# Altium project PIC12F675_prt_V3.PrjPcb
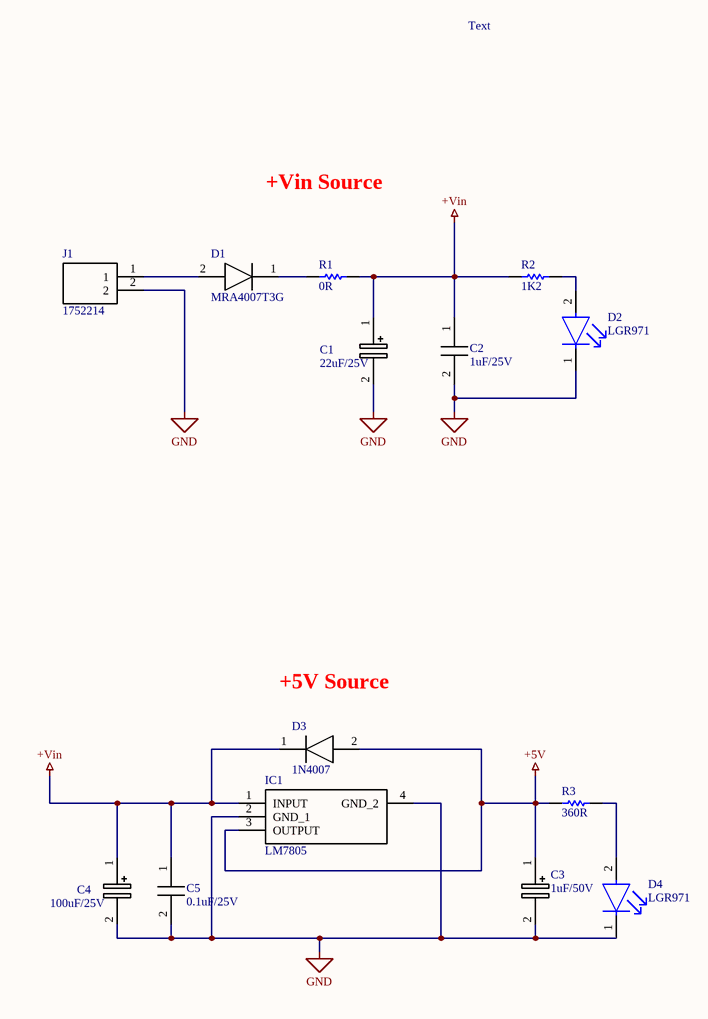
[diagram p0: power.SchDoc]
3 sheets, 82 parts. Net scope: global (net labels, ports and power ports of the same name join across sheets).
Board files: Emulator.PcbDoc, Filter.PcbDoc
Sheets:
  power.SchDoc
  uCCtrl.SchDoc
  Filter.SchDoc

## Sheet power.SchDoc
size B

### Parts
C1  22uF/25V  [CAPAE530X610N]
C2  1uF/25V  [CAPC2012X70N]
C3  1uF/50V  [CAPAE430X550N]
C4  100uF/25V  [CAPAE660X770N]
C5  0.1uF/25V  [CAPC2012X70N]
D1  MRA4007T3G  [DIOM5226X220N]
D2  LGR971  [FP-LG_R971-MFG]
D3  1N4007  [DIOM5027X244N]
D4  LGR971  [FP-LG_R971-MFG]
IC1  LM7805  [SOT230P700X180-4N]
J1  1752214  [1752214]
R1  0R  [RESC2013X55X40NL15T20]
R2  1K2  [RESC2013X55X40NL15T20]
R3  360R  [RESC2013X55X40NL15T20]

### Nets
+5V: C3.1(+) D3.2(A) IC1.3(OUTPUT) R3.2
+Vin: C1.1(+) C2.1 C4.1(+) C5.1 D3.1(K) IC1.1(INPUT) R1.2 R2.2
GND: C1.2(-) C2.2 C3.2(-) C4.2(-) C5.2 D2.1(C) D4.1(C) IC1.2(GND_1) IC1.4(GND_2) J1.2
NetD1_1: D1.1(K) R1.1
NetD1_2: D1.2(A) J1.1
NetD2_2: D2.2(A) R2.1
NetD4_2: D4.2(A) R3.1

### Notes on the sheet
- Text
- +Vin Source
- +5V Source

### Library data of the parts
C1 = APXG250ARA220ME61G: Capacitor Polarised; Manufacturer_Name: Chemi-Con; Datasheet Link: https://datasheet.datasheetarchive.com/originals/distributors/Datasheets_SAMA/b8919aa5cd8c8f60981088f28d7e01af.pdf; Height: 6.1mm; Manufacturer_Part_Number: APXG250ARA220ME61G; Mouser Part Number: 661-APXG250A220ME61G; Mouser Price/Stock: https://www.mouser.co.uk/ProductDetail/Chemi-Con/APXG250ARA220ME61G?qs=FBI%252BX3tnPf3pLyDPuxZA9A%3D%3D; Arrow Part Number: APXG250ARA220ME61G; Arrow Price/Stock: https://www.arrow.com/en/products/apxg250ara220me61g/united-chemi-con?region=nac
C2 C5 = GRM216F51E104ZA01D: Capacitor; Manufacturer_Name: Murata Electronics; Datasheet Link: http://www.murata.com/~/media/webrenewal/support/library/catalog/products/capacitor/mlcc/c02e.pdf; Height: 0.7mm; Manufacturer_Part_Number: GRM216F51E104ZA01D; Mouser Part Number: 81-GRM40Y104Z25D; Mouser Price/Stock: https://www.mouser.co.uk/ProductDetail/Murata-Electronics/GRM216F51E104ZA01D?qs=duOfYTBEatk23Zc3Fu%2FfWg%3D%3D
C3 = 865060640001: Capacitor Polarised; Manufacturer_Name: Wurth Elektronik; Datasheet Link: http://katalog.we-online.de/pbs/datasheet/865060640001.pdf; Height: 5.5mm; Manufacturer_Part_Number: 865060640001; Mouser Part Number: 710-865060640001; Mouser Price/Stock: https://www.mouser.co.uk/ProductDetail/Wurth-Elektronik/865060640001?qs=0KOYDY2FL29jNN4jHhp9bQ%3D%3D
C4 = 865090445008: Capacitor Polarised; Manufacturer_Name: Wurth Elektronik; Datasheet Link: https://componentsearchengine.com/Datasheets/1/865090445008.pdf; Height: 7.7mm; Manufacturer_Part_Number: 865090445008; Mouser Part Number: 710-865090445008; Mouser Price/Stock: https://www.mouser.co.uk/ProductDetail/Wurth-Elektronik/865090445008?qs=0KOYDY2FL2%252B%2F1BMZ3gQUdQ%3D%3D
D1 = MRA4007T3G: Diode; Manufacturer_Name: onsemi; Datasheet Link: https://www.onsemi.com/pub/Collateral/MRA4003T3-D.PDF; Height: 2.2mm; Manufacturer_Part_Number: MRA4007T3G; Mouser Part Number: 863-MRA4007T3G; Mouser Price/Stock: https://www.mouser.co.uk/ProductDetail/onsemi/MRA4007T3G?qs=ZpPixqFcBtze9zNLkB8kog%3D%3D; Arrow Part Number: MRA4007T3G; Arrow Price/Stock: https://www.arrow.com/en/products/mra4007t3g/on-semiconductor?region=nac
D2 D4 = CMP-62016-000039-1: LED GREEN DIFFUSED 0805 SMD; Test Current: 20mA; Power Dissipation: 65mW; Number of LEDs: 1; Viewing Angle: 160°; Lens Color: White; Lens Size: 1.25mm; Forward Voltage: 2.2V; Reverse Voltage: 12V; Forward Current: 25mA; Luminous Intensity: 45mcd; Luminous Flux: 0.1lm; Dominant Wavelength: 570nm; Min Operating Temperature: -30°C; Packaging: Tape and Reel; Radiation Hardening: No; Number of Pins: 2; Case Code (Imperial): 0805; Lens Style: Diffused; Mount: Surface Mount; Package Quantity: 1; Case Code (Metric): 2012; Color: Green; Case/Package: 0805; Width: 1.25mm; Illumination Color: Green; Lens Transparency: Diffused; Max Operating Temperature: 85°C; Number of Elements: 1; Depth: 1.35mm; Height: 0.9mm; Length: 2.1mm
D3 = 1n4007-SMD: Diode; Manufacturer_Name: SYC; Datasheet Link: http://www.sycelectronica.com.ar/semiconductores/1N4007-SMD.pdf; Height: 2.438mm; Manufacturer_Part_Number: 1n4007-SMD
IC1 = LM7805MPX_NOPB: Integrated Circuit; Manufacturer_Name: Texas Instruments; Manufacturer_Part_Number: LM7805MPX/NOPB; Datasheet Link: https://www.arrow.com/en/products/lm7805mpxnopb/texas-instruments; Height: 1.8mm; Mouser Part Number: 595-LM7805MPX/NOPB; Mouser Price/Stock: https://www.mouser.co.uk/ProductDetail/Texas-Instruments/LM7805MPX-NOPB?qs=gO6GG99qvRCSwIVAoVKHPw%3D%3D; Arrow Part Number: LM7805MPX/NOPB; Arrow Price/Stock: https://www.arrow.com/en/products/lm7805mpxnopb/texas-instruments?region=nac
J1 = 1752214: Connector; Manufacturer_Name: Phoenix Contact; Datasheet Link: https://datasheet.datasheetarchive.com/originals/distributors/Datasheets_SAMA/4c4c9ca6f67cab8b5ed03ba5edf5cd72.pdf; Height: 12.65mm; Manufacturer_Part_Number: 1752214; Mouser Part Number: 651-1752214; Mouser Price/Stock: https://www.mouser.co.uk/ProductDetail/Phoenix-Contact/1752214?qs=Fz3yxlUjJZFFayST2%2F%2Ff6A%3D%3D; Arrow Part Number: 1752214; Arrow Price/Stock: https://www.arrow.com/en/products/1752214/phoenix-contact?region=nac
R1-R3 = CMP-2001-04755-1: Manufacturer: Vishay Dale; Part Number: TNPW08052K00BEEN

## Sheet uCCtrl.SchDoc
size B
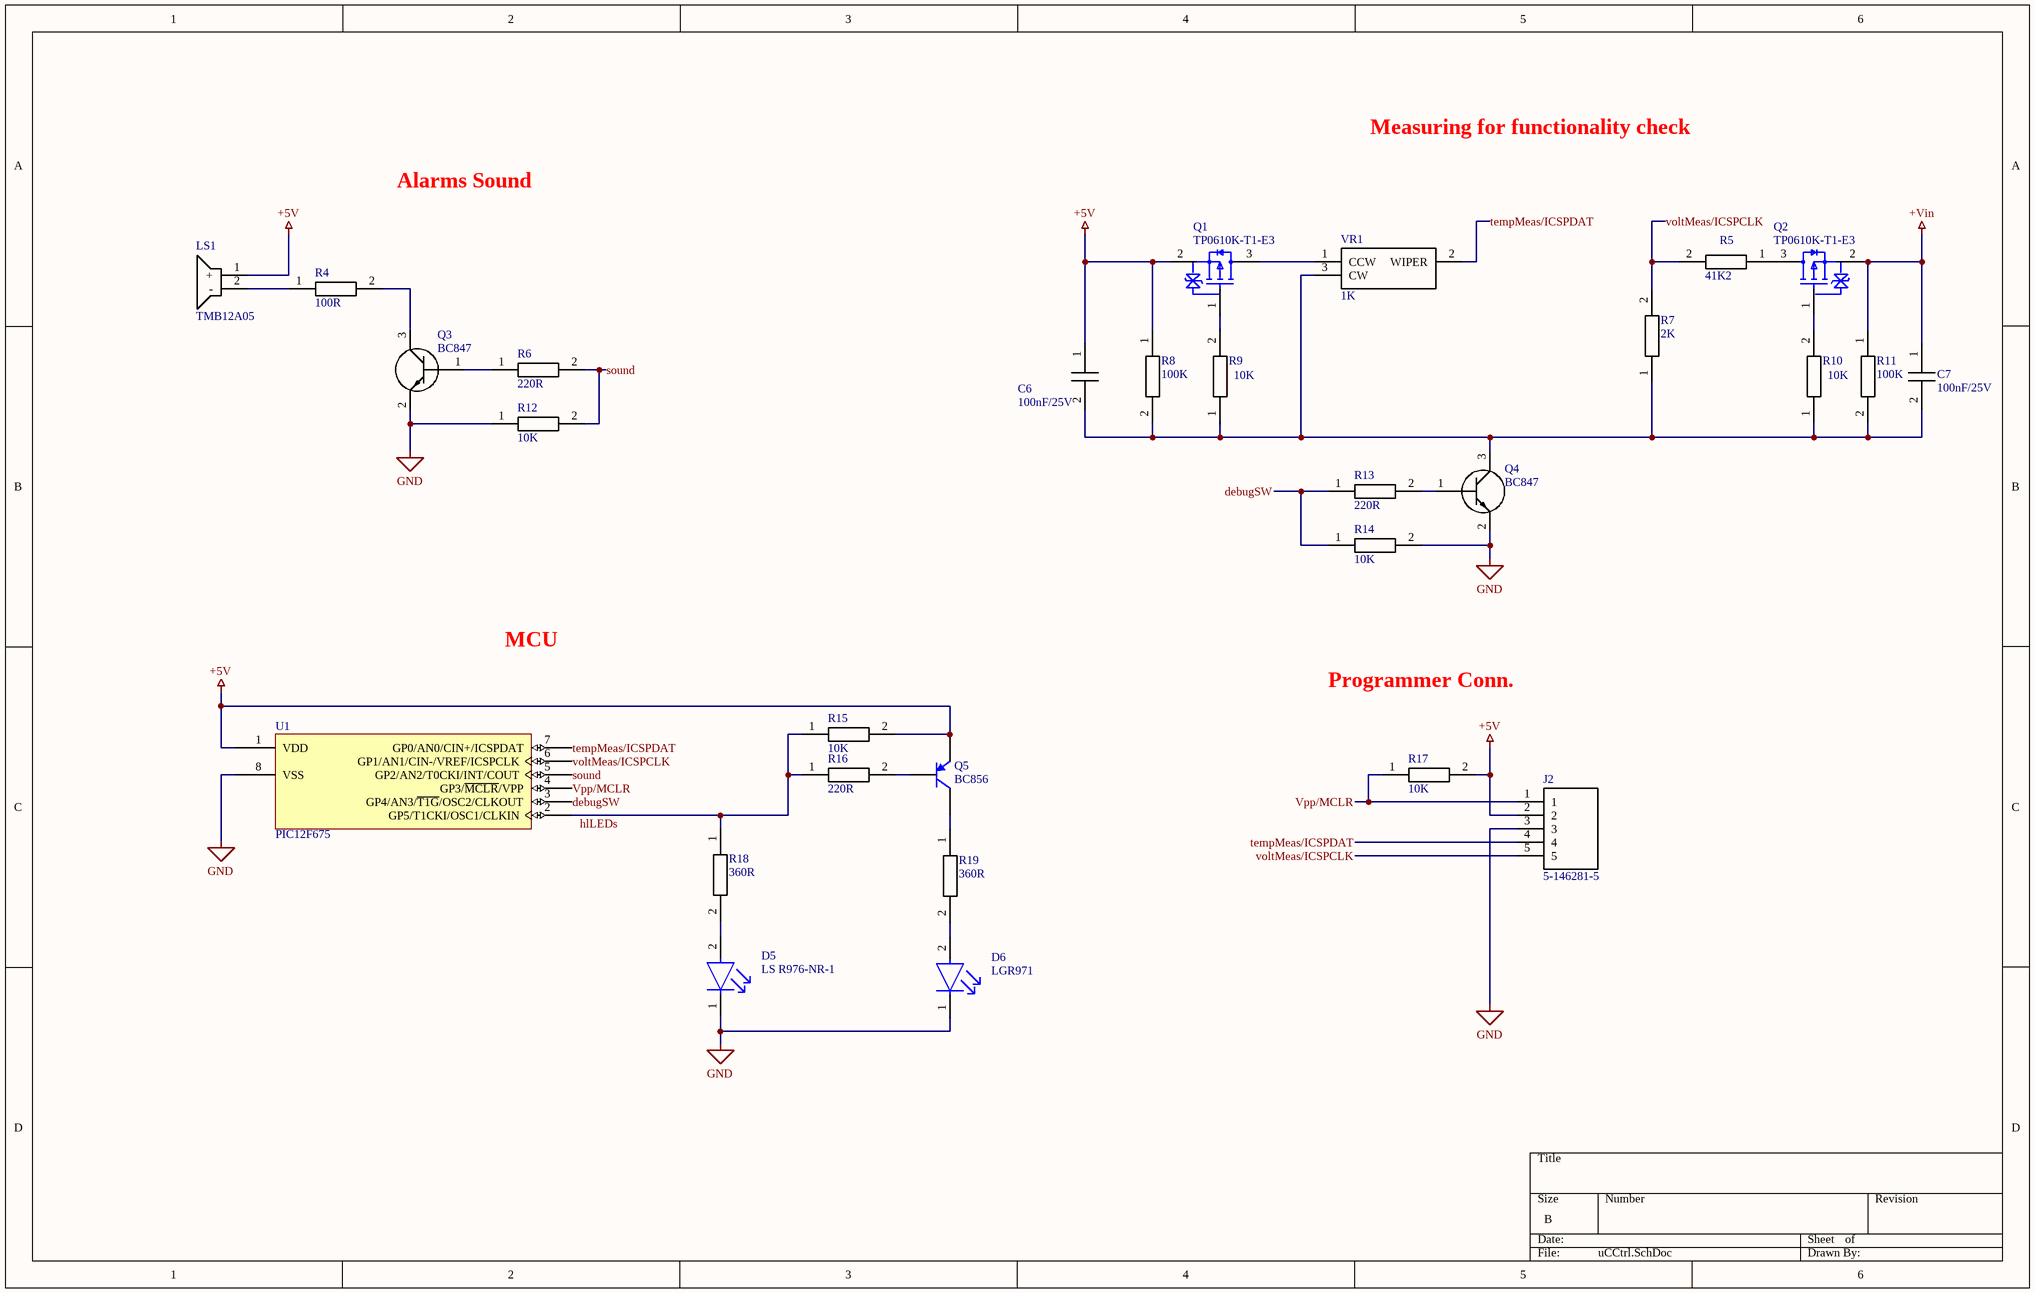
[diagram p1: uCCtrl.SchDoc]

### Parts
C6  100nF/25V  [CAPC2012X95N]
C7  100nF/25V  [CAPC2012X95N]
D5  LS R976-NR-1  [FP-LS_R976-MFG]
D6  LGR971  [FP-LG_R971-MFG]
J2  5-146281-5  [HDRV5W67P0X254_1X5_1229X234X821P]
LS1  TMB12A05  [TMB12A05]
Q1  TP0610K-T1-E3  [FP-S-03946-MFG]
Q2  TP0610K-T1-E3  [FP-S-03946-MFG]
Q3  BC847  [BC847215]
Q4  BC847  [BC847215]
Q5  BC856  [NXP-SOT23-3_V]
R4  100R  [RESC2012X60N]
R5  41K2  [RESC2012X65N]
R6  220R  [RESC2012X65N]
R7  2K  [RESC2012X65N]
R8  100K  [RESC2012X65N]
R9  10K  [RESC2012X65N]
R10  10K  [RESC2012X65N]
R11  100K  [RESC2012X65N]
R12  10K  [RESC2012X65N]
R13  220R  [RESC2012X65N]
R14  10K  [RESC2012X65N]
R15  10K  [RESC2012X65N]
R16  220R  [RESC2012X65N]
R17  10K  [RESC2012X65N]
R18  360R  [RESC2012X65N]
R19  360R  [RESC2012X65N]
U1  PIC12F675  [PDIP300-P8]
VR1  1K  [23SR1KLFTR]

### Nets
+5V: C6.1 J2.2 LS1.1(+) Q1.2(S) Q5.2(E) R8.1 R15.2 R17.2 U1.1(VDD)
+Vin: C7.1 Q2.2(S) R11.1
GND: D5.1(C) D6.1(C) J2.3 Q3.2(E) Q4.2(E) R12.1 R14.2 U1.8(VSS)
debugSW: R13.1 R14.1 U1.3(GP4/AN3/~{T1G}/OSC2/CLKOUT)
hlLEDs: R15.1 R16.1 R18.1 U1.2(GP5/T1CKI/OSC1/CLKIN)
sound: R6.2 R12.2 U1.5(GP2/AN2/T0CKI/INT/COUT)
tempMeas/ICSPDAT: J2.4 U1.7(GP0/AN0/CIN+/ICSPDAT) VR1.2(WIPER)
voltMeas/ICSPCLK: J2.5 R5.2 R7.2 U1.6(GP1/AN1/CIN-/VREF/ICSPCLK)
Vpp/MCLR: J2.1 R17.1 U1.4(GP3/~{MCLR}/VPP)
NetC6_2: C6.2 C7.2 Q4.3(C) R7.1 R8.2 R9.1 R10.1 R11.2 VR1.3(CW)
NetD5_2: D5.2(A) R18.2
NetD6_2: D6.2(A) R19.2
NetLS1_2: LS1.2(-) R4.1
NetQ1_1: Q1.1(G) R9.2
NetQ1_3: Q1.3(D) VR1.1(CCW)
NetQ2_1: Q2.1(G) R10.2
NetQ2_3: Q2.3(D) R5.1
NetQ3_1: Q3.1(B) R6.1
NetQ3_3: Q3.3(C) R4.2
NetQ4_1: Q4.1(B) R13.2
NetQ5_1: Q5.1(B) R16.2
NetQ5_3: Q5.3(C) R19.1

### Notes on the sheet
- Measuring for functionality check
- Alarms Sound
- MCU
- Programmer Conn.

### Library data of the parts
C6 C7 = GRM219B31E684KA88D: Capacitor; Manufacturer_Name: Murata Electronics; Datasheet Link: http://www.murata.com/~/media/webrenewal/support/library/catalog/products/capacitor/mlcc/c02e.pdf; Height: 0.95mm; Manufacturer_Part_Number: GRM219B31E684KA88D
D5 = CMP-62016-000037-1: LED RED DIFFUSED 0805 SMD; Lens Size: 1.25mm; Number of LEDs: 1; Luminous Intensity: 180mcd; Dominant Wavelength: 633nm; Lens Style: Flat; Reverse Voltage: 12V; Lens Color: White; Forward Voltage: 2.5V; Forward Current: 25mA; Power Dissipation: 65W; Luminous Flux: 0.47lm; Test Current: 20mA; Viewing Angle: 160°; Length: 2mm; Number of Pins: 2; Lens Transparency: Diffused; Min Operating Temperature: -30°C; Case Code (Metric): 2012; Depth: 1.35mm; Color: Red; Illumination Color: Red; Max Operating Temperature: 85°C; Mount: Surface Mount; Case/Package: 0805; Height: 0.9mm; Package Quantity: 16000; Number of Elements: 1; Radiation Hardening: No; Case Code (Imperial): 0805; Packaging: Tape and Reel; Width: 1.25mm
D6 = CMP-62016-000039-1: as D2 on sheet power; Min Operating Temperature: -30°C; Packaging: Tape and Reel; Radiation Hardening: No; Number of Pins: 2; Case Code (Imperial): 0805; Lens Style: Diffused; Mount: Surface Mount; Package Quantity: 1; Case Code (Metric): 2012; Color: Green; Case/Package: 0805; Width: 1.25mm; Illumination Color: Green; Lens Transparency: Diffused; Max Operating Temperature: 85°C; Number of Elements: 1; Depth: 1.35mm; Height: 0.9mm; Length: 2.1mm
J2 = 5-146281-5: Connector; Manufacturer_Name: TE Connectivity; Datasheet Link: https://www.te.com/commerce/DocumentDelivery/DDEController?Action=showdoc&DocId=Customer+Drawing%7F146281%7FG2%7Fpdf%7FEnglish%7FENG_CD_146281_G2.pdf%7F5-146281-5; Height: 8.21mm; Manufacturer_Part_Number: 5-146281-5; Mouser Part Number: 571-5-146281-5; Mouser Price/Stock: https://www.mouser.co.uk/ProductDetail/TE-Connectivity/5-146281-5?qs=bwpFY26eRVcDY9brDBVAcw%3D%3D; Arrow Part Number: 5-146281-5; Arrow Price/Stock: https://www.arrow.com/en/products/5-146281-5/te-connectivity?region=nac
LS1 = TMB12A05: Loudspeaker or Buzzer; Manufacturer_Name: Jiangsu Huaneng Elec; Datasheet Link: https://datasheet.lcsc.com/szlcsc/Jiangsu-Huaneng-Elec-TMB12A05_C96093.pdf; Height: 9.5mm; Manufacturer_Part_Number: TMB12A05
Q1 Q2 = CMP-02550-000129-1: MOSFET P-CH 60V 185MA SOT23-3; Manufacturer: Vishay; Drain To Source Voltage: -60V; Depletion Mode: False; Max Junction Temp: +150°C; Threshold Vgs Max: -3V; Rthja Max: 350°C/W; Max Forward Diode Voltage: -1.4V; Gate Charge At Vgs: 1.7nC @ -15V; Power Dissipation: 350mW; Turn Off Delay Time: 35ns; Number Of P Channels: 1; Standoff Height: 0.01mm; Input Capacitace At Vds: 23pF @ -25V; Gate To Source Voltage: 20V; Turn On Delay Time: 20ns; Continuous Drain Current: -185mA; Drain To Source Resistance: 6Ω; Threshold Vgs Min: -1V; Pulse Drain Current: -800mA; Temperature: -55°C to +150°C; Digikey Description: MOSFET P-CH 60V 185MA SOT23-3; Drain To Source Breakdown Voltage: -60V; Category: Trans; Temperature Range High: +150°C; Ipc Land Pattern Name: SOT95P237X100-3; Height: 1.12mm; Temperature Range Low: -55°C; Device Class L3: MOSFETs; Manufacturer Part Number: TP0610K-T1-E3; Number Of Channels: 1; ComponentLink2Description: Datasheet; RoHS: TRUE; Lead Free: Yes; Package: S-03946; Mouser Description: Mosfet; P-ch; Vdss -60V; Rds(on) 10 Ohms; Id -185MA; TO-236 (SOT-23); Pd 350MW; -55DEGC; Automotive: No; Device Class L2: Transistors; Device Class L1: Discrete Semiconductors; Octopart: https://octopart.com/tp0610k-t1-e3-vishay-40944172; ComponentLink2URL: http://www.vishay.com/docs/71411/tp0610k.pdf
Q3 Q4 = BC847,215: Transistor BJT NPN; Manufacturer_Name: Nexperia; Datasheet Link: https://assets.nexperia.com/documents/data-sheet/BC847_SER.pdf; Height: 1.1mm; Manufacturer_Part_Number: BC847,215; Mouser Part Number: 771-BC847215; Mouser Price/Stock: https://www.mouser.co.uk/ProductDetail/Nexperia/BC847215?qs=me8TqzrmIYWROhdFmDauyQ%3D%3D; Arrow Part Number: BC847,215; Arrow Price/Stock: https://www.arrow.com/en/products/bc847215/nexperia?region=nac
Q5 = CMP-2000-05936-1: PNP General Purpose Transistor, 65 V, -65 to 150 degC, 3-Pin SOT23, RoHS; Manufacturer: NXP; No. of Pins: 3; Voltage Vcbo: 80V; Power Dissipation Ptot Max: 250mW; Current Ic hFE: 2mA; Collector Emitter Voltage V(br)ceo: 65V; Hfe Min: 125; Continuous Collector Current Ic Max: 100mA; Gain Bandwidth ft Typ: 150MHz; Transistor Case Style: SOT-23; No. of Transistors: 1; Package Version: 02/2016; SMD Marking: 3D; Gain Bandwidth ft Min: 100MHz; SVHC: NoSVHC(19-Dec-2012); Noise Factor Max: 10dB; Collector Emitter Voltage Vces: -300mV; Operating Temperature Range: -65°Cto+150°C; Datasheet URL: http://www.nxp.com/documents/data_sheet/BC856_BC857_BC858.pdf; Device Marking: BC856; Mounting Technology: SurfaceMount; Package Reference: SOT23-3; Operating Temperature Max: 150°C; Package / Case: SOT-23; DC Current Gain hFE: 125; Current Ic Continuous a Max: 100mA; Power Dissipation Pd: 250mW; Manufacturer URL: http://www.nxp.com/; Termination Type: SMD; Transistor Polarity: PNP; Package URL: http://www.nxp.com/documents/outline_drawing/SOT23.pdf; DC Collector Current: 100mA; Operating Temperature Min: -65°C; Package Description: 3-Pin Small Outline Transistor, Body 1.3 x 2.9 mm, Pitch 0.95 mm; Datasheet Version: 01/2004
R4 = CRCW0805100RFKEAHP: Resistor; Manufacturer_Name: Vishay; Datasheet Link: https://componentsearchengine.com/Datasheets/1/CRCW08051R00FKEAHP.pdf; Height: 0.6mm; Manufacturer_Part_Number: CRCW0805100RFKEAHP; Mouser Part Number: 71-CRCW0805100RFKEAH; Mouser Price/Stock: https://www.mouser.co.uk/ProductDetail/Vishay-Dale/CRCW0805100RFKEAHP?qs=k2%2FDWSARqgHN0DmoUSjg4g%3D%3D; Arrow Part Number: CRCW0805100RFKEAHP; Arrow Price/Stock: https://www.arrow.com/en/products/crcw0805100rfkeahp/vishay?region=nac
R5 = CPF0805B41K2E1: Resistor; Manufacturer_Name: TE Connectivity; Datasheet Link: http://docs-europe.electrocomponents.com/webdocs/13d1/0900766b813d116f.pdf; Height: 0.65mm; Manufacturer_Part_Number: CPF0805B41K2E1
R6 R12-R16 = CPF0805B220RE: Resistor; Manufacturer_Name: TE Connectivity; Datasheet Link: http://docs-europe.electrocomponents.com/webdocs/13d1/0900766b813d116f.pdf; Height: 0.65mm; Manufacturer_Part_Number: CPF0805B220RE
R7-R11 R17-R19 = CPF0805B360RE1: Resistor; Manufacturer_Name: TE Connectivity; Datasheet Link: http://docs-europe.electrocomponents.com/webdocs/13d1/0900766b813d116f.pdf; Height: 0.65mm; Manufacturer_Part_Number: CPF0805B360RE1; Mouser Part Number: 279-CPF0805B360RE1; Mouser Price/Stock: https://www.mouser.co.uk/ProductDetail/TE-Connectivity-Holsworthy/CPF0805B360RE1?qs=iJVBkmKXgrlAzfqD%252B6zqmg%3D%3D
U1 = CMP-0190-00021-1: FLASH-Based 8-Bit CMOS Microcontroller, 10-Bit A/D, 8-Pin PDIP, Industrial Temperature; Note1: Refer to data sheet (DS41190F) for details of supply voltage range under different conditions.; DatasheetVersion: revF, Sep-2009; Code_JEDEC: MS-001; PackageVersion: revBB, Aug-2009; PackageDescription: 8-Lead Plastic Dual In-Line (P) - 300 mil Body [PDIP]; PackageReference: PDIP300-P8
VR1 = 23SR1KLFTR: Variable Resistor; Manufacturer_Name: TT Electronics; Datasheet Link: https://www.mouser.com/datasheet/2/414/23-1527241.pdf; Height: 2.73mm; Manufacturer_Part_Number: 23SR1KLFTR

## Sheet Filter.SchDoc
size B
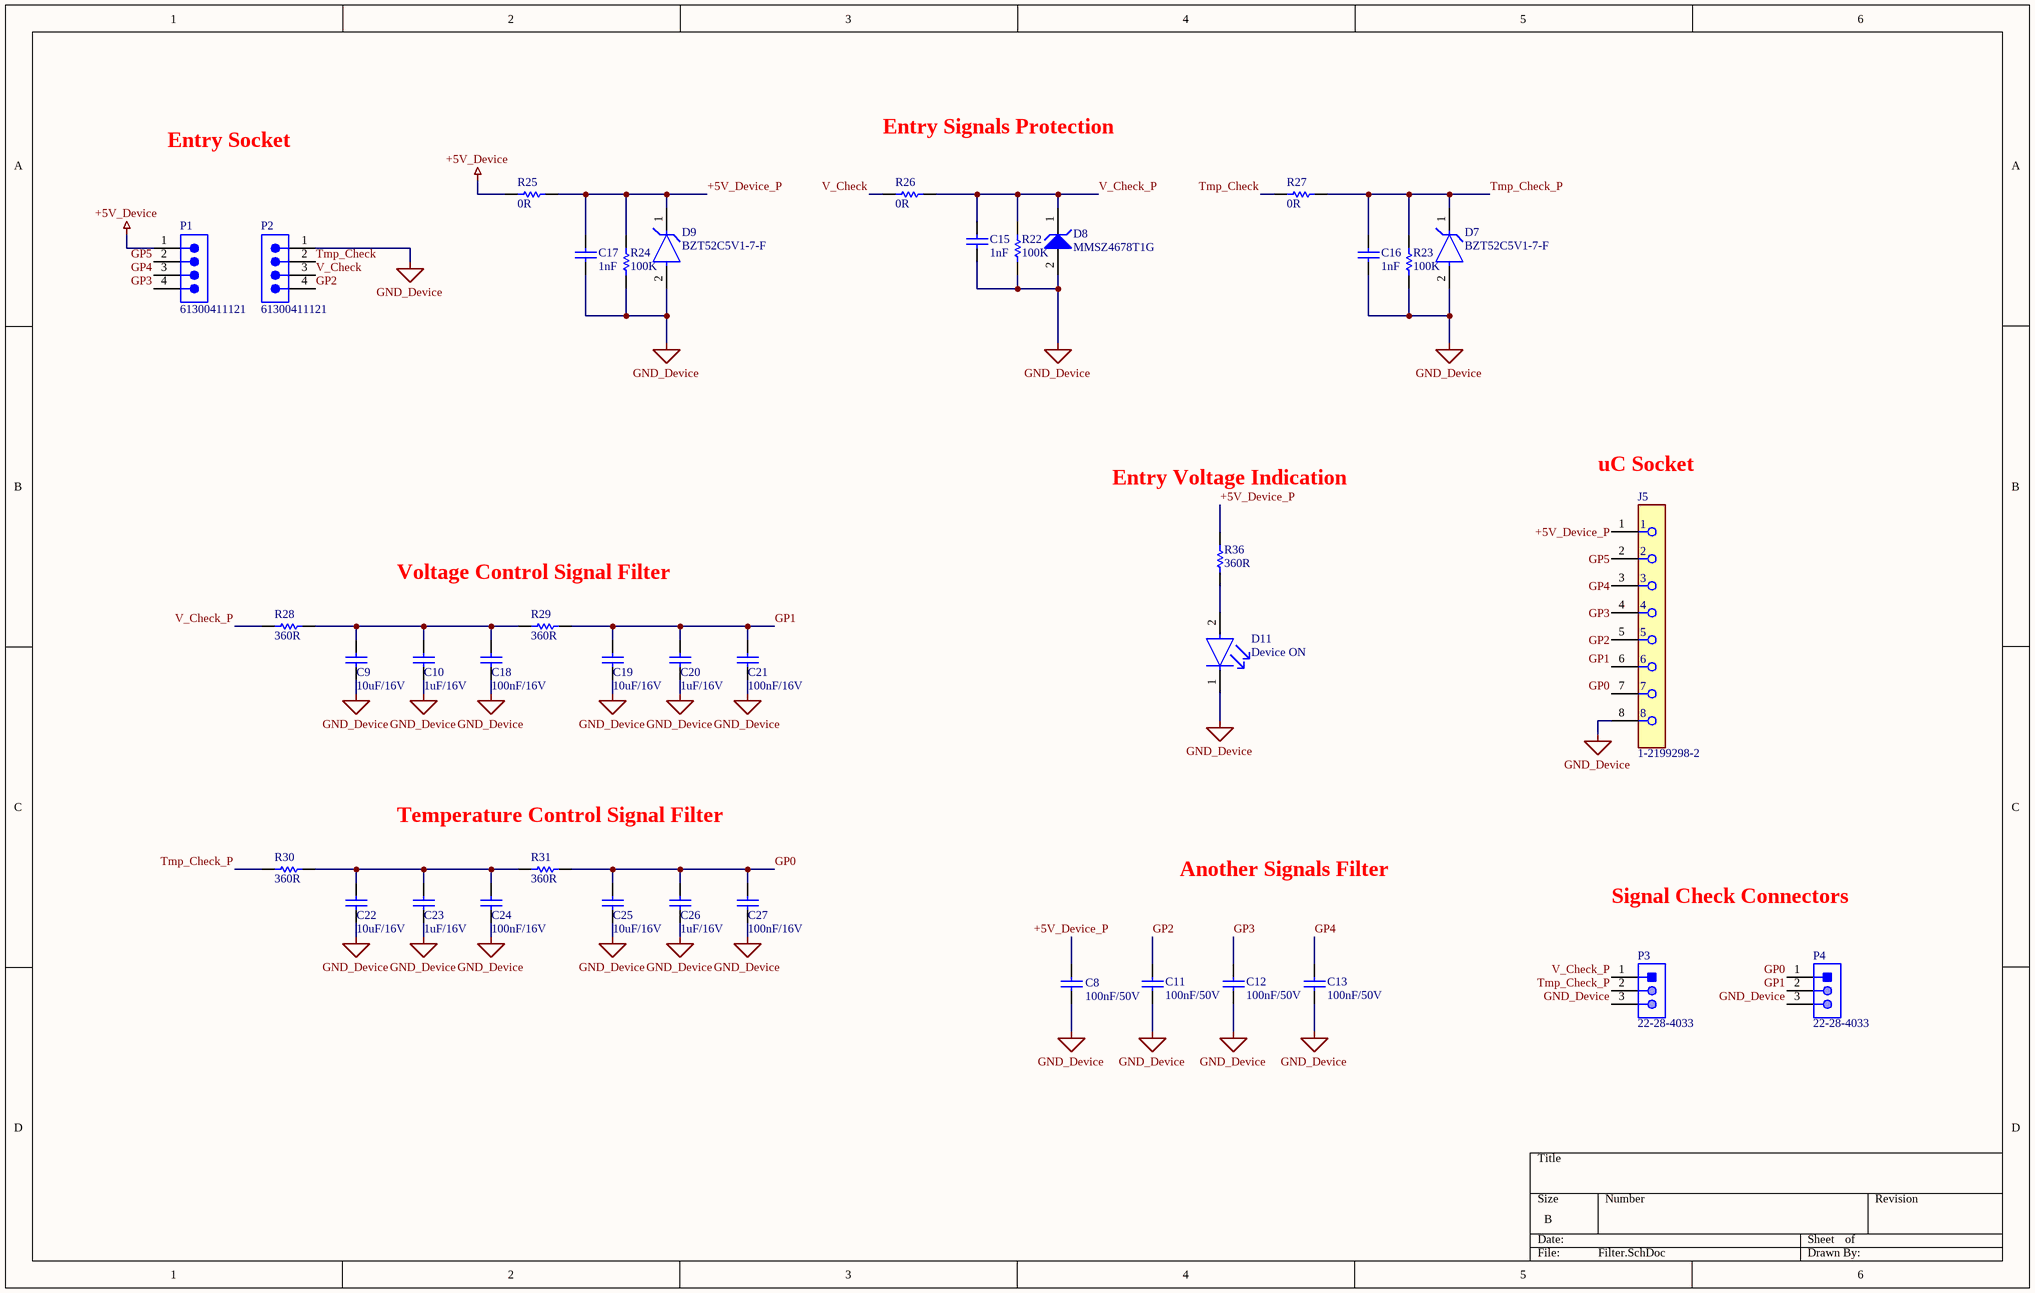
[diagram p2: Filter.SchDoc]

### Parts
C8  100nF/50V  [CAPC2013X145X48NL20T23]
C9  10uF/16V  [CAPC2013X145X48NL20T23]
C10  1uF/16V  [CAPC2013X145X48NL20T23]
C11  100nF/50V  [CAPC2013X145X48NL20T23]
C12  100nF/50V  [CAPC2013X145X48NL20T23]
C13  100nF/50V  [CAPC2013X145X48NL20T23]
C15  1nF  [CAPC2013X145X48ML20T23]
C16  1nF  [CAPC2013X145X48ML20T23]
C17  1nF  [CAPC2013X145X48ML20T23]
C18  100nF/16V  [CAPC2013X145X48NL20T23]
C19  10uF/16V  [CAPC2013X145X48NL20T23]
C20  1uF/16V  [CAPC2013X145X48NL20T23]
C21  100nF/16V  [CAPC2013X145X48NL20T23]
C22  10uF/16V  [CAPC2013X145X48NL20T23]
C23  1uF/16V  [CAPC2013X145X48NL20T23]
C24  100nF/16V  [CAPC2013X145X48NL20T23]
C25  10uF/16V  [CAPC2013X145X48NL20T23]
C26  1uF/16V  [CAPC2013X145X48NL20T23]
C27  100nF/16V  [CAPC2013X145X48NL20T23]
D7  BZT52C5V1-7-F  [FP-SOD123-MFG]
D8  MMSZ4678T1G  [ONSC-SOD-123-2-425-04_V]
D9  BZT52C5V1-7-F  [FP-SOD123-MFG]
D11  Device ON  [FP-LS_R976-MFG]
J5  1-2199298-2  [FP-1-2199298-2-MFG]
P1  61300411121  [61300411121]
P2  61300411121  [61300411121]
P3  22-28-4033  [MOLX-22-28-4033_V]
P4  22-28-4033  [MOLX-22-28-4033_V]
R22  100K  [RESC2013X55X40NL15T20]
R23  100K  [RESC2013X55X40NL15T20]
R24  100K  [RESC2013X55X40NL15T20]
R25  0R  [RESC2013X55X40NL15T20]
R26  0R  [RESC2013X55X40NL15T20]
R27  0R  [RESC2013X55X40NL15T20]
R28  360R  [RESC2013X55X40NL15T20]
R29  360R  [RESC2013X55X40NL15T20]
R30  360R  [RESC2013X55X40NL15T20]
R31  360R  [RESC2013X55X40NL15T20]
R36  360R  [RESC2013X55X40NL15T20]

### Nets
+5V_Device: P1.1 R25.2
GND_Device: C8.1 C9.1 C10.1 C11.2 C12.2 C13.2 C15.1 C16.1 C17.1 C18.1 C19.1 C20.1 C21.1 C22.1 C23.1 C24.1 C25.1 C26.1 C27.1 D7.2(A) D8.2(A) D9.2(A) D11.1(C) J5.8 P2.1 P3.3 P4.3 R22.1 R23.1 R24.1
+5V_Device_P: C8.2 C17.2 D9.1(C) J5.1 R24.2 R25.1 R36.2
GP0: C25.2 C26.2 C27.2 J5.7 P4.1 R31.1
GP1: C19.2 C20.2 C21.2 J5.6 P4.2 R29.1
GP2: C11.1 J5.5 P2.4
GP3: C12.1 J5.4 P1.4
GP4: C13.1 J5.3 P1.3
GP5: J5.2 P1.2
Tmp_Check: P2.2 R27.2
Tmp_Check_P: C16.2 D7.1(C) P3.2 R23.2 R27.1 R30.2
V_Check: P2.3 R26.2
V_Check_P: C15.2 D8.1(K) P3.1 R22.2 R26.1 R28.2
NetC9_2: C9.2 C10.2 C18.2 R28.1 R29.2
NetC22_2: C22.2 C23.2 C24.2 R30.1 R31.2
NetD11_2: D11.2(A) R36.1

### Notes on the sheet
- Entry Socket
- Entry Signals Protection
- Entry Voltage Indication
- uC Socket
- (near R29) Voltage Control Signal Filter
- (near R31) Temperature Control Signal Filter
- Another Signals Filter
- Signal Check Connectors

### Library data of the parts
C8-C13 C18-C27 = CMP-2007-03167-1: Manufacturer: Vitramon; Part Number: VJ0805Y104KNAAT
C15-C17 = CMP-2007-03154-1: Part Number: VJ0805Y102KXAMC; Manufacturer: Vitramon
D7 D9 = CMP-2000-05976-2: DIODE ZENER 5.1V 500MW SOD123; Manufacturer: Diodes Incorporated; Standoff Height: 0mm; Max Reverse Leakage Current: 2uA; Forward Current: 10mA; Power Dissipation: 370mW; Max Zener Voltage: 5.4V; Zener Impedance: 60Ω; Automotive Grade: NA; Max Junction Temp: +150°C; Device Class L3: Zener Diodes; ComponentLink2Description: Datasheet; Manufacturer Part Number: BZT52C5V1-7-F; Mouser Description: Zener Diodes 5.1V 500mW; Octopart: https://octopart.com/bzt52c5v1-7-f-diodes+inc.-326718; Package: SOD123; RoHS: TRUE; Nom Zener Voltage: 5.1V; Device Class L1: Discrete Semiconductors; Lead Free: Yes; Footprint Url: https://www.diodes.com/assets/Package-Files/SOD123.pdf; ComponentLink2URL: https://www.diodes.com/assets/Datasheets/ds18004.pdf; Digikey Description: DIODE ZENER 5.1V 500MW SOD123; Height: 1.45mm; Temperature Range Low: -65°C; Device Class L2: Diodes; Temperature: -65°C to +150°C; Automotive: No; Temperature Range High: +150°C; Category: Diode
D8 = CMP-1060-00511-1: Zener Voltage Regulator, 500 mW, 2-Pin SOD-123, Pb-Free, Tape and Reel; Manufacturer: On Semiconductor; P Max (W): 0.5; VZ Typ (V): 1.8; PackageDescription: 2-Pin SOD, Body 1.6 x 2.69 mm; ComponentLink3Description: Package Specification; PackageReference: SOD-123-2-425-04; RoHS: Pb-Free; PackageVersion: Rev. G, 10/2009; Packing: Tape and Reel; ComponentLink1URL: http://www.onsemi.com/; ComponentLink2Description: Datasheet; ComponentLink3URL: http://www.onsemi.com/pub_link/Collateral/425-04.PDF; ComponentLink2URL: http://www.onsemi.com/pub_link/Collateral/MMSZ4678T1-D.PDF; DatasheetVersion: Rev. 9; ComponentLink1Description: Manufacturer URL; Mounting Technology: Surface Mount; PartNumber: MMSZ4678T1G
D11 = CMP-62016-000037-1: as D5 on sheet uCCtrl; Length: 2mm; Number of Pins: 2; Lens Transparency: Diffused; Min Operating Temperature: -30°C; Case Code (Metric): 2012; Depth: 1.35mm; Color: Red; Illumination Color: Red; Max Operating Temperature: 85°C; Mount: Surface Mount; Case/Package: 0805; Height: 0.9mm; Package Quantity: 16000; Number of Elements: 1; Radiation Hardening: No; Case Code (Imperial): 0805; Packaging: Tape and Reel; Width: 1.25mm
J5 = CMP-03370-000009-1: CONN IC DIP SOCKET 8POS TIN; Contact Post Length: 3inch; Number of Contacts: 8; Contact Current Rating: 1A; Contact Resistance: 20mR; Insulation Resistance: 1GR; Connector Type: Pin; Row Spacing: 0.3inch; Pitch: 2.54mm; Mating Alignment: Yes (With); RoHS Compliant: Yes; Packaging: Rail/Tube; Contact Material: Bronze; Lead Pitch: 2.54mm; Mount: Through Hole; Termination: Through Hole; Max Operating Temperature: 105°C; Flammability Rating: UL94 V-0; Package Quantity: 60; Contact Finish - Mating: TIN; ELV: Compliant; Radiation Hardening: No; Number of Rows: 2; Series: Diplomate DL; Color: Black; Number of Positions: 8; Contact Plating: Tin; Min Operating Temperature: -40°C; Lead Free: Lead Free; Length: 0.4inch; Orientation: Straight; Housing Material: PBT
P1 P2 = CMP-1502-01064-3: NexarPartId: 32855522; Operating Supply Voltage: 250V; Pitch: 2.54mm; Contact Resistance: 20mΩ; Number of Positions: 4; Current Rating: 3A; Connector Type: Male Pin; Gender: Male; Contact Plating: Gold; Height: 8.89mm; Lead Pitch: 2.54mm; Lead Free: Lead Free; Contact Mating Length: 5.9944mm; Number of Rows: 1; Termination: Solder; Packaging: Bulk; REACH SVHC: Unknown; Min Operating Temperature: -40°C; RoHS: Compliant; Number of Contacts: 4; Voltage Rating: 250V; Color: Black; Max Operating Temperature: 105°C; Contact Material: Copper; Mount: Through Hole; Orientation: Vertical; Number of Pins: 4
P3 P4 = CMP-1676-00001-5: Male Header, Pitch 2.54 mm, 1 x 3 Position, Height 8.38 mm, Tail Length 3.18 mm, RoHS, Bulk; Manufacturer: Molex; Rows: 1; Voltage Rating: 250 V; Current Rating: 4 A; Min Operating Temperature: 0 degC; Lead Pitch: 0.1 inch; Packaging: Bulk; Contact Finish: Gold; RoHSCompliant: true; Contact Material: Brass; PackageReference: 22-28-4033; REACH SVHC: Unknown; PackageDescription: Male Header, Pitch 2.54 mm, 1 x 3 Position, Height 8.38 mm, Tail Length 3.18 mm; ComponentLink2URL: http://www.molex.com/pdm_docs/sd/022284033_sd.pdf; Height: 8.38 mm; Mounting Technology: Through Hole; ComponentLink1Description: Manufacturer URL; Length: 7.62 mm; Mount: Through Hole; DatasheetVersion: Rev. G, 01/2012; Max Operating Temperature: 75 degC; ComponentLink2Description: Datasheet; Colour: Black; Pins: 3; Contact Plating: Gold; Package Quantity: 1; ComponentLink1URL: http://www.molex.com/
R22-R31 R36 = CMP-2001-04755-1: as R1 on sheet power

## Nets that join several sheets
+5V: power (C3.1 D3.2 IC1.3 R3.2), uCCtrl (9 pins)
+Vin: power (8 pins), uCCtrl (C7.1 Q2.2 R11.1)
GND: power (10 pins), uCCtrl (8 pins)